# Altium schematic sheet 10 Speaker_Microphone.SchDoc
size 420 x 297 mm; Organization: Altium Limited; Address1: L3, 12a Rodborough Rd; Address2: Frenchs Forest; Address3: NSW; Address4: Australia 2086
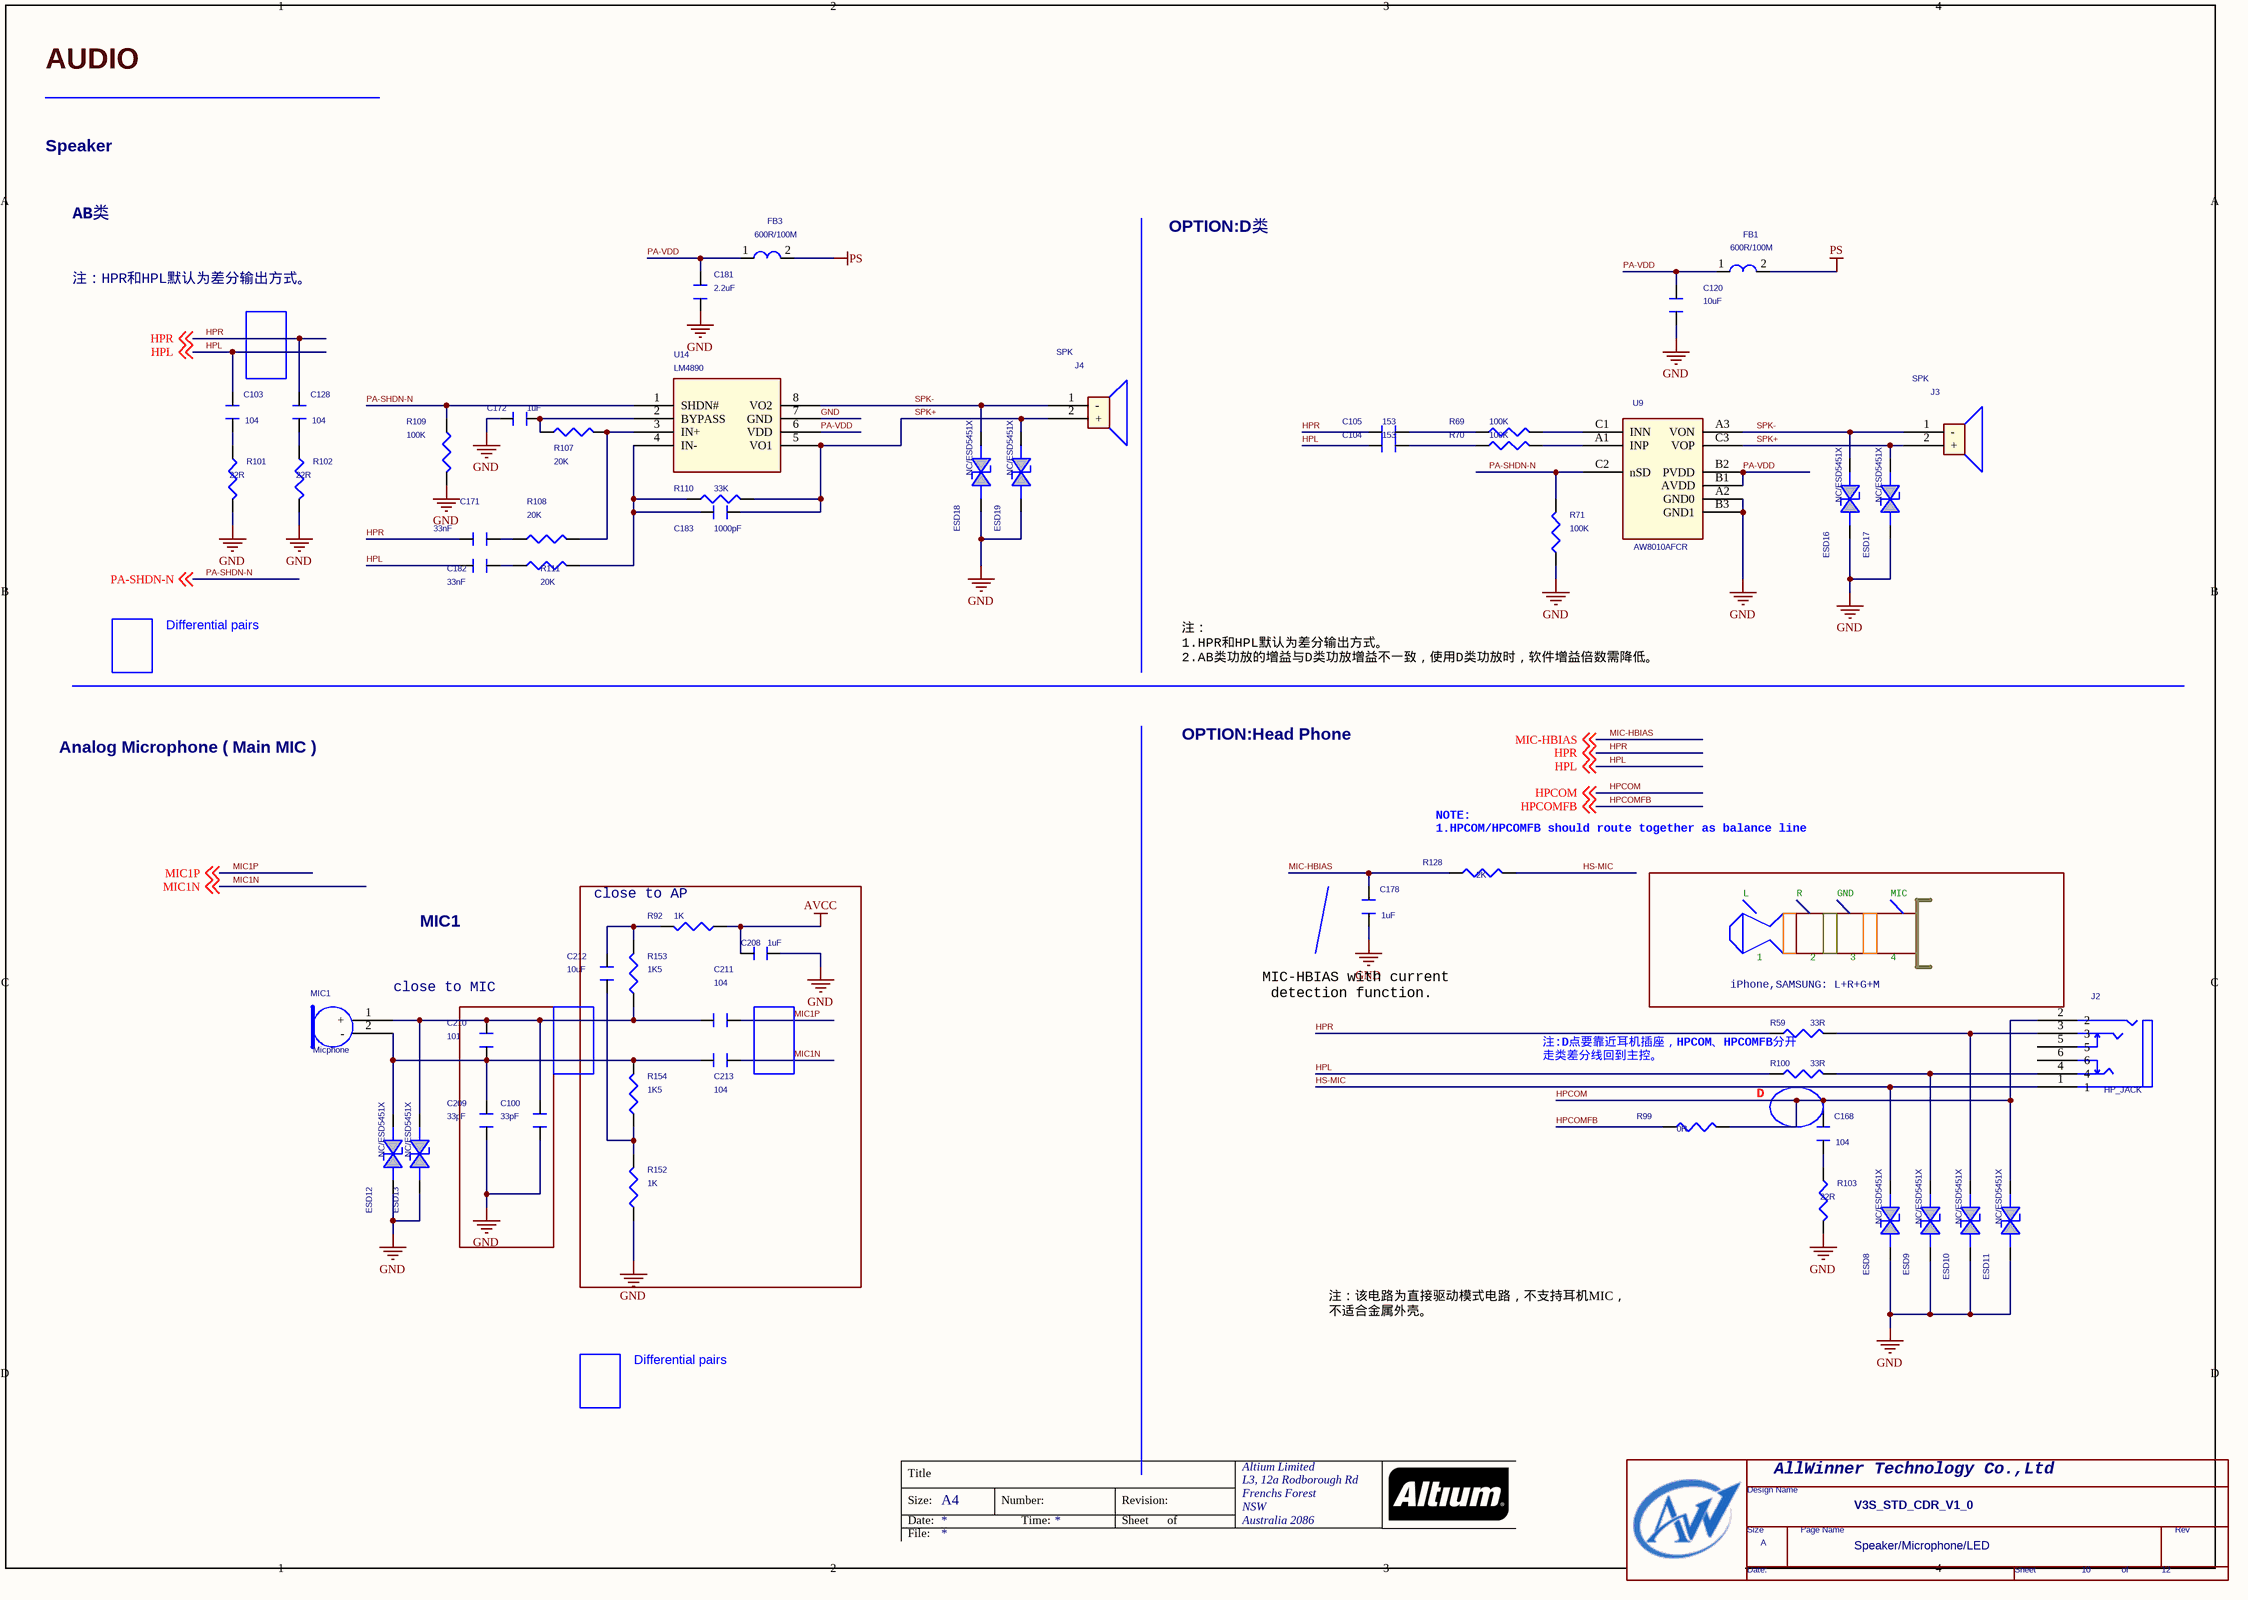
[diagram p0: 10 Speaker_Microphone.SchDoc]

## Parts
*  Page Count: 12  Page Number: 10  Page Size: A  Title: V3S_STD_CDR_V1_0  Doc: Speaker/Microphone/LED  (hidden comment: TitleBlock0-AW)  (graphical)
C100  33pF  [C0402]
C103  104  [C0402]
C104  153  [C0402]
C105  153  [C0402]
C120  10uF  [C0603]
C128  104  [C0402]
C168  104  [C0402]
C171  33nF  [C0402]
C172  1uF  [C0402]
C178  1uF  [C0402]
C181  2.2uF  [C0402]
C182  33nF  [C0402]
C183  1000pF  [C0402]
C208  1uF  [C0402]
C209  33pF  [C0402]
C210  101  [C0402]
C211  104  [C0402]
C212  10uF  [C0603]
C213  104  [C0402]
ESD8  NC/ESD5451X  [ESD0402]
ESD9  NC/ESD5451X  [ESD0402]
ESD10  NC/ESD5451X  [ESD0402]
ESD11  NC/ESD5451X  [ESD0402]
ESD12  NC/ESD5451X  [ESD0402]
ESD13  NC/ESD5451X  [ESD0402]
ESD16  NC/ESD5451X  [ESD0402]
ESD17  NC/ESD5451X  [ESD0402]
ESD18  NC/ESD5451X  [ESD0402]
ESD19  NC/ESD5451X  [ESD0402]
FB1  600R/100M  [L0603]
FB3  600R/100M  [L0603]
J2  HP_JACK  [EAR-JACK-3-5]
J3  SPK  [Phone Connector]
J4  SPK  [Phone Connector]
MIC1  Micphone  [Micphone Connector]
R59  33R  [R0805]
R69  100K  [R0402]
R70  100K  [R0402]
R71  100K  [R0402]
R92  1K  [R0402]
R99  0R  [0805]
R100  33R  [R0805]
R101  22R  [0805]
R102  22R  [0805]
R103  22R  [0805]
R107  20K  [R0402]
R108  20K  [R0402]
R109  100K  [R0402]
R110  33K  [R0402]
R111  20K  [R0402]
R128  2K  [R0402]
R152  1K  [R0402]
R153  1K5  [R0402]
R154  1K5  [R0402]
U9  AW8010AFCR  [CSP9]
U14  LM4890  [MSOP8]

## Blocks framed on the sheet
close to AP: C208 C211-C213 R92 R152-R154

## Nets
AVCC: C208.2 R92.1
GND: C100.1 C120.1 C172.1 C178.1 C181.1 C208.1 C209.1 ESD8.2(CATHODE) ESD9.2(CATHODE) ESD10.2(CATHODE) ESD11.2(CATHODE) ESD12.2(CATHODE) ESD13.2(CATHODE) ESD16.2(CATHODE) ESD17.2(CATHODE) ESD18.2(CATHODE) ESD19.2(CATHODE) R71.1 R101.1 R102.1 R103.1 R109.2 R152.1 U9.A2(GND0) U9.B3(GND1) U14.7(GND)
PS: FB1.2 FB3.2
HPCOM: C168.2 ESD11.1(ANODE) J2.2 R99.1 ; off-sheet HPCOM
HPCOMFB: R99.2 ; off-sheet HPCOMFB
HPL: C103.2 C104.2 C182.1 R100.1 ; off-sheet HPL
HPR: C105.2 C128.2 C171.1 R59.1 ; off-sheet HPR
HS-MIC: ESD8.1(ANODE) J2.1 R128.1
MIC1N: C213.1 ; off-sheet MIC1N
MIC1P: C211.1 ; off-sheet MIC1P
MIC-HBIAS: C178.2 R128.2 ; off-sheet MIC-HBIAS
PA-SHDN-N: R71.2 R109.1 U9.C2(nSD) U14.1(SHDN#) ; off-sheet PA-SHDN-N
PA-VDD: C120.2 C181.2 FB1.1 FB3.1 U9.B1(AVDD) U9.B2(PVDD) U14.6(VDD)
SPK+: C183.2 ESD17.1(ANODE) ESD19.1(ANODE) J3.2(+) J4.2(+) R110.2 U9.C3(VOP) U14.5(VO1)
SPK-: ESD16.1(ANODE) ESD18.1(ANODE) J3.1(-) J4.1(-) U9.A3(VON) U14.8(VO2)
NetC100_2: C100.2 C210.2 C211.2 ESD13.1(ANODE) MIC1.1(+) R153.1
NetC103_1: C103.1 R101.2
NetC104_1: C104.1 R70.1
NetC105_1: C105.1 R69.1
NetC128_1: C128.1 R102.2
NetC168_1: C168.1 R103.2
NetC171_2: C171.2 R108.1
NetC172_2: C172.2 R107.1 U14.2(BYPASS)
NetC182_2: C182.2 R111.1
NetC183_1: C183.1 R110.1 R111.2 U14.4(IN-)
NetC209_2: C209.2 C210.1 C213.2 ESD12.1(ANODE) MIC1.2(-) R154.2
NetC212_1: C212.1 R152.2 R154.1
NetC212_2: C212.2 R92.2 R153.2
NetESD9_1: ESD9.1(ANODE) J2.4 R100.2
NetESD10_1: ESD10.1(ANODE) J2.3 R59.2
NetR69_2: R69.2 U9.C1(INN)
NetR70_2: R70.2 U9.A1(INP)
NetR107_2: R107.2 R108.2 U14.3(IN+)

Not connected (* = marked no-connect by the designer): J2 5 6

## Notes on the sheet
- AUDIO
- Speaker
- AB类
- OPTION:D类
- 注：HPR和HPL默认为差分输出方式。
- Differential pairs
- 注：
  1.HPR和HPL默认为差分输出方式。
  2.AB类功放的增益与D类功放增益不一致，使用D类功放时，软件增益倍数需降低。
- Analog Microphone ( Main MIC )
- OPTION:Head Phone
- (near R128) NOTE:
  1.HPCOM/HPCOMFB should route together as balance line
- MIC1
- L
- R
- GND
- MIC
- close to MIC
- (near R59) iPhone,SAMSUNG: L+R+G+M
- 1
- 2
- 3
- 4
- MIC-HBIAS with current
  detection function.
- (near R59) 注:D点要靠近耳机插座，HPCOM、HPCOMFB分开
  走类差分线回到主控。
- (near R100) D
- 注：该电路为直接驱动模式电路，不支持耳机MIC，
  不适合金属外壳。
- Title
- Size:
- Date:
- A4
- Number:
- Time:
- Revision:
- Sheet
- of
- File:
- (in symbol TitleBlock0-AW) AllWinner Technology Co.,Ltd; Design Name; Size; Page Name; Rev; Date:; Sheet; of

## Library data of the parts
* = TitleBlock0-AW: RevCode: 0.1; Page Create Date: March  8, 1995
C100 C208 C209 = CAPACITOR: PAGE: 2; mypage: 13
C103 C128 C168 C178 = CAPACITOR_Dup1: PAGE: 2
C104 C105 = CAPACITOR_0_Dup5
C120 = CAPACITOR_Dup1
C171 = CAPACITOR_0_Dup3: 规格型号: 原材料; 元件类别: 电容470nF/10V,X5R,±10%,0402 每盘10K; 元件编号: 电容; 备注: YCL0816; PAGE: 1; Vendor: C0402
C172 = CAPACITOR_0_Dup3: 规格型号: 原材料; 元件类别: 电容1UF/6.3V,X5R,±10%,0402 每盘10K; 元件编号: 电容; 备注: YCL0457; PAGE: 1; Vendor: C0402
C181 = CAPACITOR_0_Dup3: PAGE: 1; 备注: YCL0302; 元件编号: 电容; 元件类别: 电容2.2UF/6.3V,X5R,±20%,0402 每盘10K; 规格型号: 原材料; Vendor: C0402
C182 = CAPACITOR_0_Dup3: PAGE: 1; 备注: YCL0816; 元件编号: 电容; 元件类别: 电容470nF/10V,X5R,±10%,0402 每盘10K; 规格型号: 原材料; Vendor: C0402
C183 = CAPACITOR_0_Dup3: PAGE: 1; 备注: YCL0641; 元件编号: 电容; 元件类别: 电容1NF/50V,X7R,±10%,0402 每盘10K; 规格型号: 原材料; Vendor: C0402
C210 = CAPACITOR: mypage: 13; PAGE: 2
C211 C213 = CAPACITOR_Dup1: PAGE: 2; mypage: 13
C212 = CAPACITOR_Dup1: mypage: 13; PAGE: 2
ESD8-ESD13 ESD16-ESD19 = 1_1.5KE100A: 1ST PART DESCRIPTION: WILL ESD9B5V Bidirection ESD Protection; Page: 11
FB1 FB3 = INDUCTOR_0_Dup1: RoHS BEAD/600ohm 100Mhz Z=600Ω DCR<0.2Ω 800mA SMT L0603; OriginalSymbolOrigin: (10,0); Pin Numbers Visible: TRUE; Pin Names Visible: FALSE; Package: SMT; Pin Names Rotate: TRUE
J2 = USB_WIFI_0
J3 J4 = SPEAKER
MIC1 = Micphone_0: mypage: 13
R59 R100 = R_Dup3
R69 R70 = RESISTOR_Dup2
R71 = R_Dup1
R92 R152-R154 = R_Dup4: mypage: 13
R99 R101-R103 = R1 0805_Dup1
R107 R108 = ?_0: 规格型号: 原材料; 元件类别: 电阻20K,±5%,1/16W,0402 每盘10K; 元件编号: 电阻; 备注: YCL0479; Vendor: R0402
R109 = ?_0: 备注: YCL0465; 元件编号: 电阻; 元件类别: 电阻100K,±5%,1/16W,0402 每盘10K; 规格型号: 原材料; Vendor: R0402
R110 = ?_0: 规格型号: 原材料; 元件类别: 电阻33K,±5%,1/16W,0402 每盘10K; 元件编号: 电阻; 备注: YCL0466; Vendor: R0402
R111 = ?_0: 备注: YCL0479; 元件编号: 电阻; 元件类别: 电阻20K,±5%,1/16W,0402 每盘10K; 规格型号: 原材料; Vendor: R0402
R128 = R_Dup4
U9 = AW8010CSR_1
U14 = LY8006_0: 备注: YCL0064; 元件编号: IC; 元件类别: 功放IC4890 / TF690; 规格型号: 原材料; Vendor: MSOP8